# Altium schematic sheet Adafruit DRV8833.SchDoc: Adafruit DRV8833
size 282 x 197 mm; Origin: Eagle; Date: 6/14/2019 1:25:19 PM; SheetNumber: 1; Author: >AUTHOR; GateName_1: G$1; SymbolName_1: FRAME_A4_ADAFRUIT; LibraryName: microbuilder; DeviceSetName: FRAME_A4_ADAFRUIT; Sheet: Sheet:; AdafruitIndustries: Adafruit Industries; Drawing: Drawing:
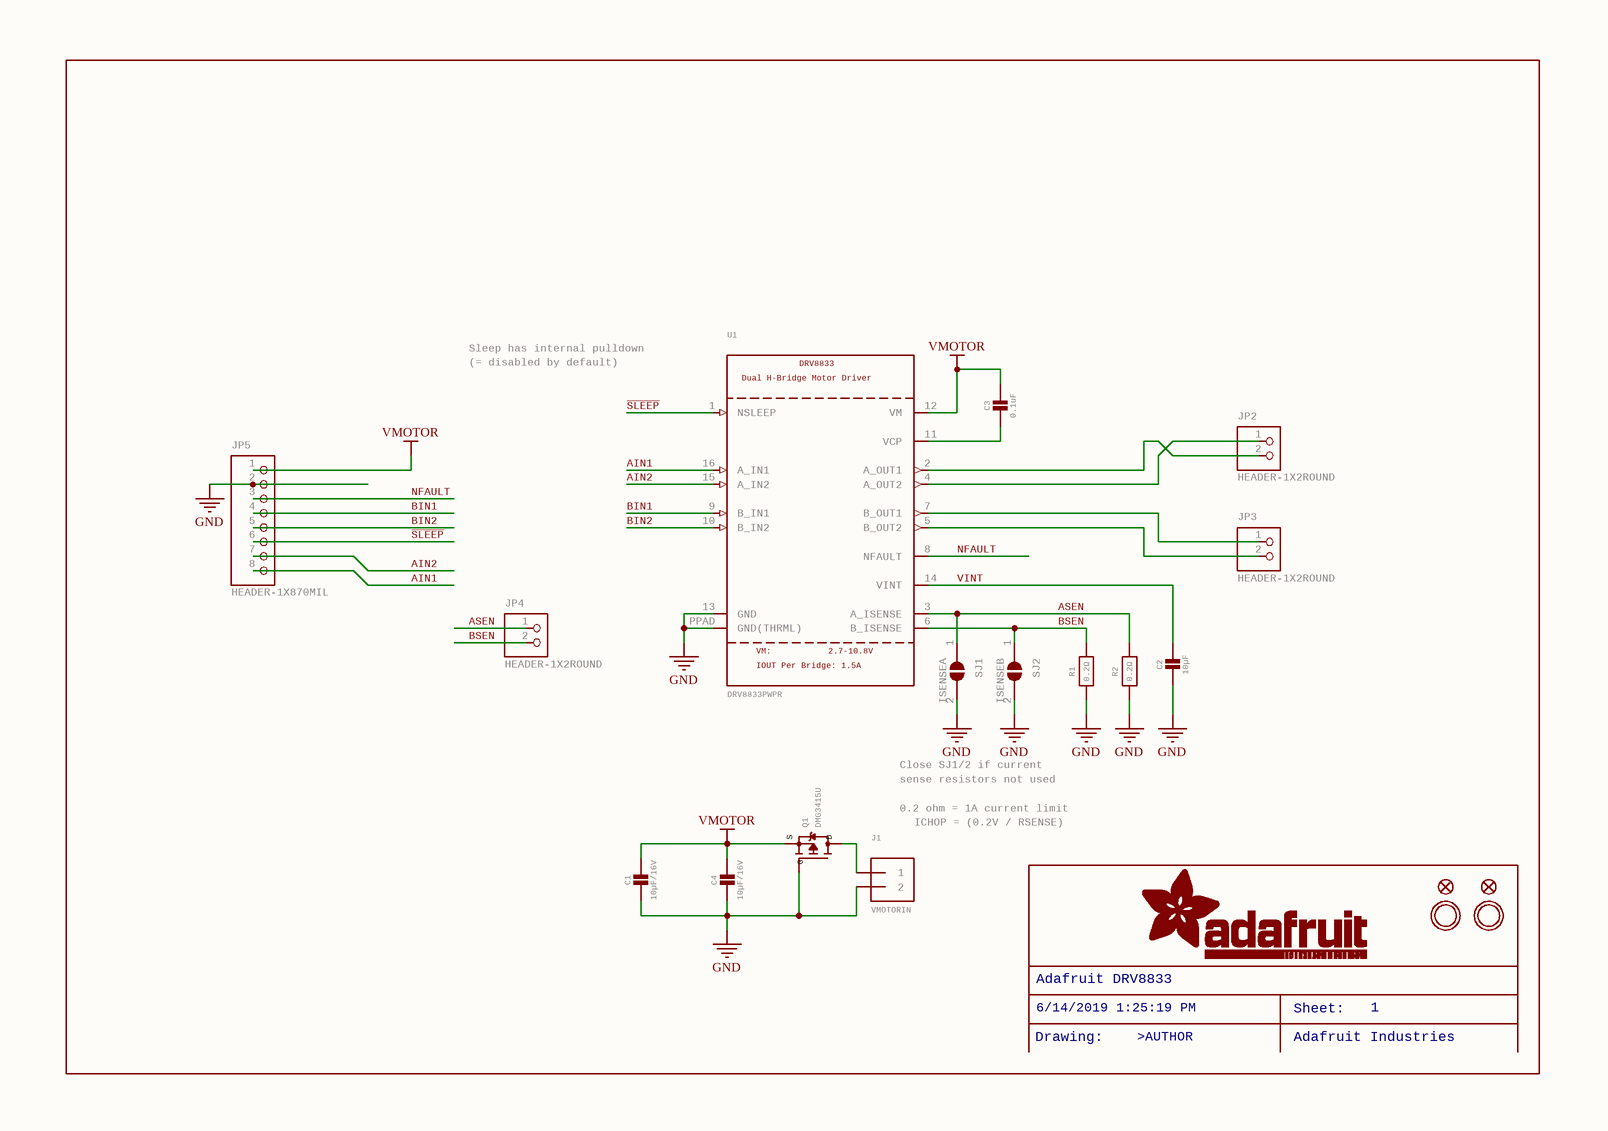
[diagram p0: Adafruit DRV8833.SchDoc]

## Parts
C1  10µF/16V  [0805-NO]
C2  10µF  [0805-NO]
C3  0.1uF  [0805-NO]
C4  10µF/16V  [0805-NO]
FID1  FIDUCIAL""  [FIDUCIAL_1MM]  (value not drawn)
FID2  FIDUCIAL""  [FIDUCIAL_1MM]  (value not drawn)
J1  VMOTORIN  [TERMBLOCK_1X2-3.5MM]
JP2  HEADER-1X2ROUND  [1X02_ROUND]
JP3  HEADER-1X2ROUND  [1X02_ROUND]
JP4  HEADER-1X2ROUND  [1X02_ROUND]
JP5  HEADER-1X870MIL  [1X08_ROUND_70]
Q1  DMG3415U  [SOT23-WIDE]
R1  0.2Ω  [_1206]
R2  0.2Ω  [_1206]
SJ1  ISENSEA  [SOLDERJUMPER_ARROW_NOPASTE]
SJ2  ISENSEB  [SOLDERJUMPER_ARROW_NOPASTE]
U1  DRV8833PWPR  DualH-BridgeMotorDriver: Dual H-Bridge Motor Driver  VM: VM:  IOUTPerBridge:1.5A: IOUT Per Bridge: 1.5A  [HTSSOP16]
U$13  MOUNTINGHOLE2.5  [MOUNTINGHOLE_2.5_PLATED]  (value not drawn)
U$14  MOUNTINGHOLE2.5  [MOUNTINGHOLE_2.5_PLATED]  (value not drawn)

## Nets
GND: C1.2 C2.2 C4.2 J1.2 JP5.2 Q1.1(G) R1.1 R2.1 SJ1.2 SJ2.2 U1.13(GND) U1.PPAD(GND(THRML))
VMOTOR: C1.1 C3.1 C4.1 JP5.1 Q1.2(S) U1.12(VM)
AIN1: JP5.8 U1.16(A_IN1)
AIN2: JP5.7 U1.15(A_IN2)
ASEN: JP4.1 R2.2 SJ1.1 U1.3(A_ISENSE)
BIN1: JP5.4 U1.9(B_IN1)
BIN2: JP5.5 U1.10(B_IN2)
BSEN: JP4.2 R1.2 SJ2.1 U1.6(B_ISENSE)
NFAULT: JP5.3 U1.8(NFAULT)
~{SLEEP}: JP5.6 U1.1(NSLEEP)
VINT: C2.1 U1.14(VINT)
NetC3_2: C3.2 U1.11(VCP)
NetJ1_1: J1.1 Q1.3(D)
NetJP2_1: JP2.1 U1.4(A_OUT2)
NetJP2_2: JP2.2 U1.2(A_OUT1)
NetJP3_1: JP3.1 U1.7(B_OUT1)
NetJP3_2: JP3.2 U1.5(B_OUT2)

## Notes on the sheet
- Sleep has internal pulldown
- (= disabled by default)
- Close SJ1/2 if current
- sense resistors not used
- 0.2 ohm = 1A current limit
- (near J1) ICHOP = (0.2V / RSENSE)
- Adafruit DRV8833
- 6/14/2019 1:25:19 PM
- Sheet:
- 1
- Drawing:
- >AUTHOR
- Adafruit Industries

## Library data of the parts
C1-C4 = CAP_CERAMIC0805-NOOUTLINE: Ceramic Capacitors   For new designs, use the packages preceded by an '_' character since they are more reliable:   The following footprints should be used on most boards: _0402 - Standard footprint for regular board layouts  _0603 - Standard footprint for regular board layouts  _0805 - Standard footprint for regular board layouts  _1206 - Standard footprint for regular board layouts       For extremely tight-pitch boards where space is at a premium, the following 'micro-pitch' footprints can be used (smaller pads, no silkscreen outline, etc.): _0402MP - Micro-pitch footprint for very dense/compact boards  _0603MP - Micro-pitch footprint for very dense/compact boards  _0805MP - Micro-pitch footprint for very dense/compact boards  _1206MP - Micro-pitch footprint for very dense/compact boards; GateName_1: G$1; SymbolName_1: CAPACITOR; DeviceName: 0805-NOOUTLINE; LibraryName: microbuilder; DeviceSetName: CAP_CERAMIC
FID1 FID2 = FIDUCIAL"": Fiducial Alignment Points   Various fiducial points for machine vision alignment.; GateName_1: G$1; DeviceName: ""; BOM: EXCLUDE; SymbolName_1: FIDUCIAL; LibraryName: microbuilder; DeviceSetName: FIDUCIAL
J1 = TERMBLOCK_1X2: 3.5mm Terminal block    http://www.ladyada.net/library/pcb/eaglelibrary.html; GateName_1: G$1; SymbolName_1: 1X2; LibraryName: microbuilder; DeviceSetName: TERMBLOCK_1X2
JP2-JP4 = HEADER-1X2ROUND: PIN HEADER; GateName_1: G$1; SymbolName_1: PINHD2; DeviceName: ROUND; LibraryName: microbuilder; DeviceSetName: HEADER-1X2
JP5 = HEADER-1X870MIL: PIN HEADER; GateName_1: A; SymbolName_1: PINHD8; DeviceName: 70MIL; LibraryName: microbuilder; DeviceSetName: HEADER-1X8
Q1 = MOSFET-PWIDE: P-Channel Mosfet   LEGEND   VDS: Voltage Drain-Source ID: Drain Current RDS(ON): Drain-Source On-State Resistance VGS(TH): Gate-Source Threshold Voltage CISS: Drain-Source Input Capacitance    SOT-23   Name	VDS	ID	RDS(ON)	VGS(TH)	CISS	Order Number	   IRLML5103	30V	760mA	600 mOhm	--	75pF @ 25V	Digikey: IRLML5103PBFCT-ND	   IRLML6401	12V	4.3A	50 mOhm	950mV @ 250ÂµA	830pF @ 10V	Digikey: IRLML6401PBFTR-ND	   NTR0202PL	20V	400mA	800 mOhm	2.3V @ 250uA	70pF @ 5V	Digikey: NTR0202PLT1GOSTR-ND	   NTR4101PT1G	20V	1.8A	85 mOhm	1.2V @ 250uA	675pF @ 10V	Digikey: NTR4101PT1GOSCT-ND	   DMP2004K	20V	600mA	900 mOhm	1V @ 250uA	175pF @ 16V	Digikey: DMP2004KDICT-ND	   PMV65XP	20V	3.9A	76 mOhm	950mV @ 1mA	725pF @ 20V	Digikey: 568-2358-2-ND	   							   							TO-252   Name	VDS	ID	RDS(ON)	VGS(TH)	CISS	Order Number	   AOD417	30V	25A	34 mOhm	3V @ 250ÂµA	920pF @ 15V	Digikey: 785-1106-2-ND; GateName_1: G$1; DeviceName: WIDE; SymbolName_1: MOSFET-P; LibraryName: microbuilder; DeviceSetName: MOSFET-P; D: D; S: S; G: G
R1 R2 = RESISTOR_1206: Resistors   For new designs, use the packages preceded by an '_' character since they are more reliable:   The following footprints should be used on most boards: _0402 - Standard footprint for regular board layouts  _0603 - Standard footprint for regular board layouts  _0805 - Standard footprint for regular board layouts  _1206 - Standard footprint for regular board layouts       For extremely tight-pitch boards where space is at a premium, the following 'micro-pitch' footprints can be used (smaller pads, no silkscreen outline, etc.): _0402MP - Micro-pitch footprint for very dense/compact boards  _0603MP - Micro-pitch footprint for very dense/compact boards  _0805MP - Micro-pitch footprint for very dense/compact boards  _1206MP - Micro-pitch footprint for very dense/compact boards; GateName_1: G$1; SymbolName_1: RESISTOR; DeviceName: _1206; LibraryName: microbuilder; DeviceSetName: RESISTOR
SJ1 SJ2 = SOLDERJUMPER: SMD Solder JUMPER   Solder the two pads together to create a connection, or remove the solder to break it.REFLOW - Use this footprint for solder paste and reflow ovens. WAVE - Use this footprint for hand-soldering (larger pads).    CLOSED - Has a trace between the two pads to ensure it is closed by default.  The trace needs to be cut to disable the jumper, and can be closed again by creating a solder bridge between the two pads.; GateName_1: 1; BOM: EXCLUDE; SymbolName_1: SOLDERJUMPER; LibraryName: microbuilder; DeviceSetName: SOLDERJUMPER
U1 = DRV8833: DRV8833 Dual H-Bridge Motor Driver -- HTSSOP Package; GateName_1: G$1; SymbolName_1: DRV8833; LibraryName: microbuilder; DeviceSetName: DRV8833; DRV8833: DRV8833; 2.7-10.8V: 2.7-10.8V
U$13 U$14 = MOUNTINGHOLE2.5: Mounting Hole   For #2 screws (0.086"/2.18mm width, 0.094"/2.4mm hole) use 2.5mm; GateName_1: G$1; DeviceName: 2.5; BOM: EXCLUDE; SymbolName_1: MOUNTINGHOLE; LibraryName: microbuilder; DeviceSetName: MOUNTINGHOLE